# EasyEDA schematic LED News ticker_2021-06-20.json
TITLE: LED connection board; REV: 1.0; Date: 2021-06-19; Sheet: 1/1; Drawn By: Ferrie Bank; Company: github.com/oudesnepelaar
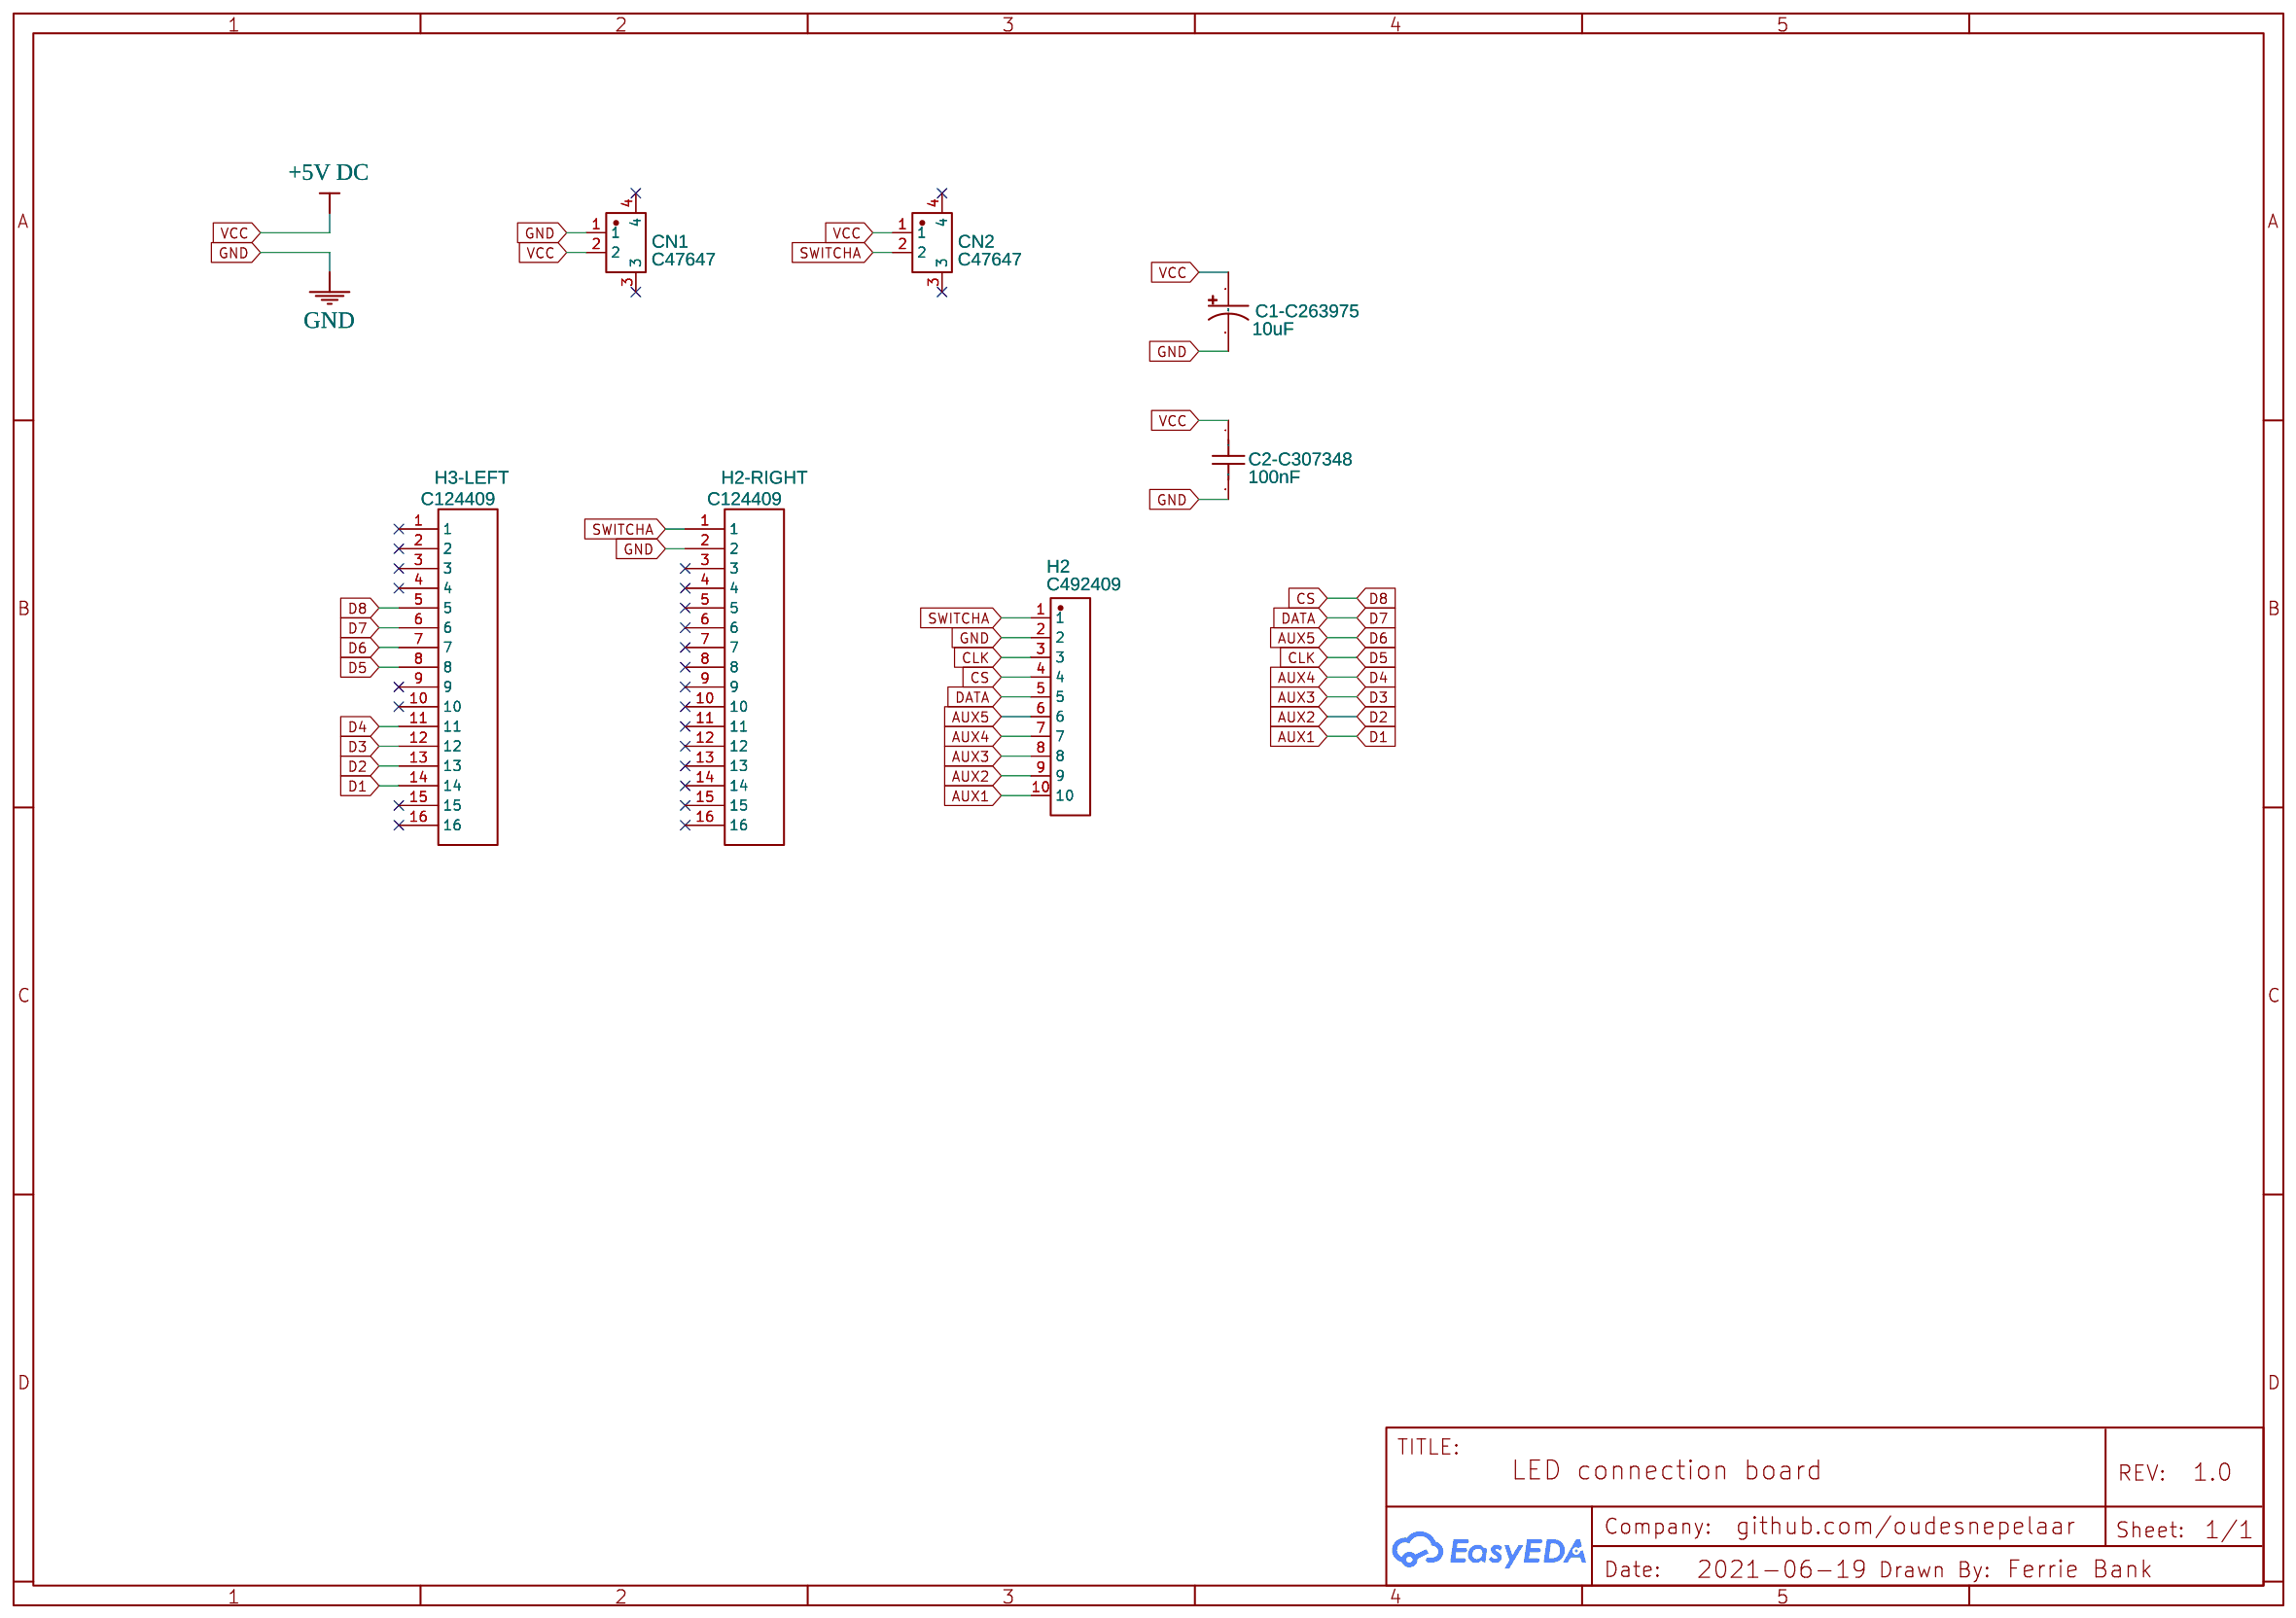
[diagram p0: schematic sheet]

## Parts
C1-C263975  10uF  [CAP-SMD_BD5.0-L5.3-W5.3-FD]
C2-C307348  100nF  [C0603]
CN1  C47647  [CONN-SMD_2P-P2.00_PH2.0-SPWB]
CN2  C47647  [CONN-SMD_2P-P2.00_PH2.0-SPWB]
H2  C492409  [HDR-TH_10P-P2.54-V-M]
H2-RIGHT  C124409  [HDR-TH_16P-P2.54-V]
H3-LEFT  C124409  [HDR-TH_16P-P2.54-V]

## Library data of the parts
C1-C263975 = CK1H100MCRD54: Supplier: LCSC; Supplier Part: C263975; Manufacturer: Semtech; Contributor: LCSC; JLCPCB Part Class: Extended Part
C2-C307348 = CL10B104KB8WPNC: Supplier: LCSC; Supplier Part: C307348; Manufacturer: Samsung Electro-Mechanics; Contributor: LCSC; JLCPCB Part Class: Extended Part
CN1 CN2 = PH2.0-2PWB: Supplier: LCSC; Manufacturer: BOOMELE; Manufacturer Part: PH2.0-2PWB Horizontal; JLCPCB Part Class: Extended Part
H2 = PZ254V-11-10P: Supplier: LCSC; Manufacturer: XFCN; Contributor: LCSC; JLCPCB Part Class: Extended Part
H2-RIGHT H3-LEFT = 220S-1*16P H=8.5MM Ytype Gold-plated: Supplier: LCSC; Manufacturer: Ckmtw; JLCPCB Part Class: Extended Part

## Nets
+5V DC: C1-C263975.1 C2-C307348.1 CN1.2 CN2.1
GND: C1-C263975.2 C2-C307348.2 CN1.1 H2.2 H2-RIGHT.2
AUX1: H2.10 H3-LEFT.14
AUX2: H2.9 H3-LEFT.13
AUX3: H2.8 H3-LEFT.12
AUX4: H2.7 H3-LEFT.11
AUX5: H2.6 H3-LEFT.7
CLK: H2.3 H3-LEFT.8
CS: H2.4 H3-LEFT.5
D7: H2.5 H3-LEFT.6
SWITCHA: CN2.2 H2.1 H2-RIGHT.1

Not connected (* = marked no-connect by the designer): CN1 3* 4*; CN2 3* 4*; H2-RIGHT 3* 4* 5* 6* 7* 8* 9* 10* 11* 12* 13* 14* 15* 16*; H3-LEFT 1* 2* 3* 4* 9* 10* 15* 16*
